# EAGLE schematic SIHMTEST (EAGLE 8.3.2)

## Sheet 1 of 2
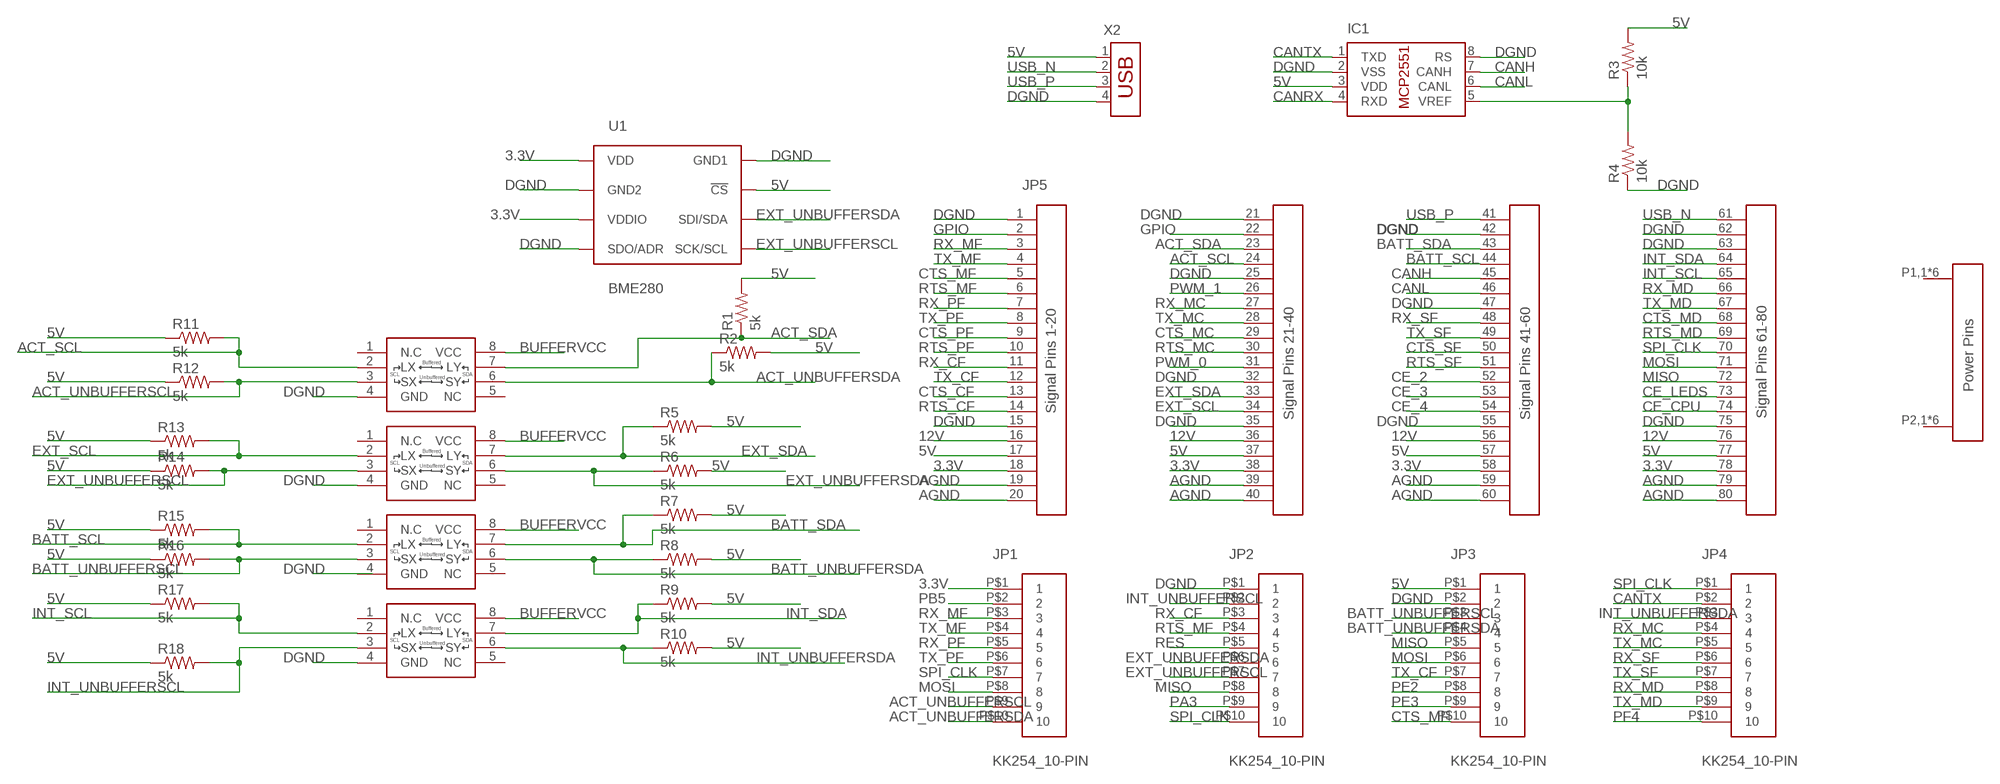
[diagram p0: schematic, sheet 1]

### Parts
IC1  MCP2551/SN  [SO08]
JP1  KK254_10-PIN  [KK254_10-PIN]
JP2  KK254_10-PIN  [KK254_10-PIN]
JP3  KK254_10-PIN  [KK254_10-PIN]
JP4  KK254_10-PIN  [KK254_10-PIN]
JP5  MPSC-01-80MPSC-RA-LC  [MPSC-01-80]
R1  5k  R-US_R0805  [R0805]
R2  5k  R-US_R0805  [R0805]
R3  10k  R-US_R0805  [R0805]
R4  10k  R-US_R0805  [R0805]
R5  5k  R-US_R0805  [R0805]
R6  5k  R-US_R0805  [R0805]
R7  5k  R-US_R0805  [R0805]
R8  5k  R-US_R0805  [R0805]
R9  5k  R-US_R0805  [R0805]
R10  5k  R-US_R0805  [R0805]
R11  5k  R-US_R0805  [R0805]
R12  5k  R-US_R0805  [R0805]
R13  5k  R-US_R0805  [R0805]
R14  5k  R-US_R0805  [R0805]
R15  5k  R-US_R0805  [R0805]
R16  5k  R-US_R0805  [R0805]
R17  5k  R-US_R0805  [R0805]
R18  5k  R-US_R0805  [R0805]
U1  BME280  [BME280_LGA]
U$1  P82B715  [SO8]
U$2  P82B715  [SO8]
U$3  P82B715  [SO8]
U$4  P82B715  [SO8]
X2  USB-787616  [USB]

### Nets
3.3V: JP1.P$1 JP5.18 JP5.38 JP5.58 JP5.78 U1.P$6(VDDIO) U1.P$8(VDD)
5V: IC1.3(VDD) JP3.P$1 JP5.17 JP5.37 JP5.57 JP5.77 R1.2 R2.2 R3.2 R5.2 R6.2 R7.2 R8.2 R9.2 R10.2 R11.1 R12.1 R13.1 R14.1 R15.1 R16.1 R17.1 R18.1 U1.P$2(!CS) X2.1
12V: JP5.16 JP5.36 JP5.56 JP5.76
ACT_SCL: JP5.24 R11.2 U$1.2(LX)
ACT_SDA: JP5.23 R1.1 U$1.7(LY)
ACT_UNBUFFERSCL: JP1.P$9 R12.2 U$1.3(SX)
ACT_UNBUFFERSDA: JP1.P$10 R2.1 U$1.6(SY)
AGND: JP5.19 JP5.20 JP5.39 JP5.40 JP5.59 JP5.60 JP5.79 JP5.80
BATT_SCL: JP5.44 R15.2 U$3.2(LX)
BATT_SDA: JP5.43 R7.1 U$3.7(LY)
BATT_UNBUFFERSCL: JP3.P$3 R16.2 U$3.3(SX)
BATT_UNBUFFERSDA: JP3.P$4 R8.1 U$3.6(SY)
BUFFERVCC: U$1.8(VCC) U$2.8(VCC) U$3.8(VCC) U$4.8(VCC)
CANH: IC1.7(CANH) JP5.45
CANL: IC1.6(CANL) JP5.46
CANRX: IC1.4(RXD)
CANTX: IC1.1(TXD) JP4.P$2
CE_2: JP5.52
CE_3: JP5.53
CE_4: JP5.54
CE_CPU: JP5.74
CE_LEDS: JP5.73
CTS_CF: JP5.13
CTS_MC: JP5.29
CTS_MD: JP5.68
CTS_MF: JP3.P$10 JP5.5
CTS_PF: JP5.9
CTS_SF: JP5.50
DGND: IC1.2(VSS) IC1.8(RS) JP2.P$1 JP3.P$2 JP5.1 JP5.15 JP5.21 JP5.25 JP5.32 JP5.35 JP5.42 JP5.47 JP5.55 JP5.62 JP5.63 JP5.75 R4.1 U1.P$1(GND1) U1.P$5(SDO/ADR) U1.P$7(GND2) U$1.4(GND) U$2.4(GND) U$4.4(GND) X2.4
EXT_SCL: JP5.34 R13.2 U$2.2(LX)
EXT_SDA: JP5.33 R5.1 U$2.7(LY)
EXT_UNBUFFERSCL: JP2.P$7 R14.2 U1.P$4(SCK/SCL) U$2.3(SX)
EXT_UNBUFFERSDA: JP2.P$6 R6.1 U1.P$3(SDI/SDA) U$2.6(SY)
GPIO: JP5.2 JP5.22
INT_SCL: JP5.65 R17.2 U$4.2(LX)
INT_SDA: JP5.64 R9.1 U$4.7(LY)
INT_UNBUFFERSCL: JP2.P$2 R18.2 U$4.3(SX)
INT_UNBUFFERSDA: JP4.P$3 R10.1 U$4.6(SY)
MISO: JP2.P$8 JP3.P$5 JP5.72
MOSI: JP1.P$8 JP3.P$6 JP5.71
N$2: IC1.5(VREF) R3.1 R4.2
PA3: JP2.P$9
PB5: JP1.P$2
PE2: JP3.P$8
PE3: JP3.P$9
PF4: JP4.P$10
PWM_0: JP5.31
PWM_1: JP5.26
RES: JP2.P$5
RTS_CF: JP5.14
RTS_MC: JP5.30
RTS_MD: JP5.69
RTS_MF: JP2.P$4 JP5.6
RTS_PF: JP5.10
RTS_SF: JP5.51
RX_CF: JP2.P$3 JP5.11
RX_MC: JP4.P$4 JP5.27
RX_MD: JP4.P$8 JP5.66
RX_MF: JP1.P$3 JP5.3
RX_PF: JP1.P$5 JP5.7
RX_SF: JP4.P$6 JP5.48
SPI_CLK: JP1.P$7 JP2.P$10 JP4.P$1 JP5.70
TX_CF: JP3.P$7 JP5.12
TX_MC: JP4.P$5 JP5.28
TX_MD: JP4.P$9 JP5.67
TX_MF: JP1.P$4 JP5.4
TX_PF: JP1.P$6 JP5.8
TX_SF: JP4.P$7 JP5.49
USB_N [usb]: JP5.61 X2.2
USB_P [usb]: JP5.41 X2.3
Unconnected: JP5.P1,1(POWER1) JP5.P1,2(POWER1) JP5.P1,3(POWER1) JP5.P1,4(POWER1) JP5.P1,5(POWER1) JP5.P1,6(POWER1) JP5.P2,1(POWER2) JP5.P2,2(POWER2) JP5.P2,3(POWER2) JP5.P2,4(POWER2) JP5.P2,5(POWER2) JP5.P2,6(POWER2) U$1.1(N.C) U$1.5(NC) U$2.1(N.C) U$2.5(NC) U$3.1(N.C) U$3.4(GND) U$3.5(NC) U$4.1(N.C) U$4.5(NC)

## Sheet 2 of 2

## Library data of the parts
IC1 = microchip-dspic:MCP2551: High-Speed CAN Transceiver
JP1-JP4 = molex:KK254_10-PIN: KK254 10-pin Datasheet <http://www.molex.com/molex/products/datasheet.jsp?part=active/0022102101_PCB_HEADERS.xml>
JP5 = samtec:MPSC-01-80
R1-R18 = resistor:R-US_: RESISTOR, American symbol
U1 = BME280ComponentLibrary:BME280; PROD_ID: IC-13090
U$1-U$4 = NXP:P82B715
X2 = con-amp:USB-787616: AMP connector

## Net classes
1 usb: clearance 0.152 mm